# EAGLE schematic L_C_ext_esp32 (EAGLE 9.6.2)
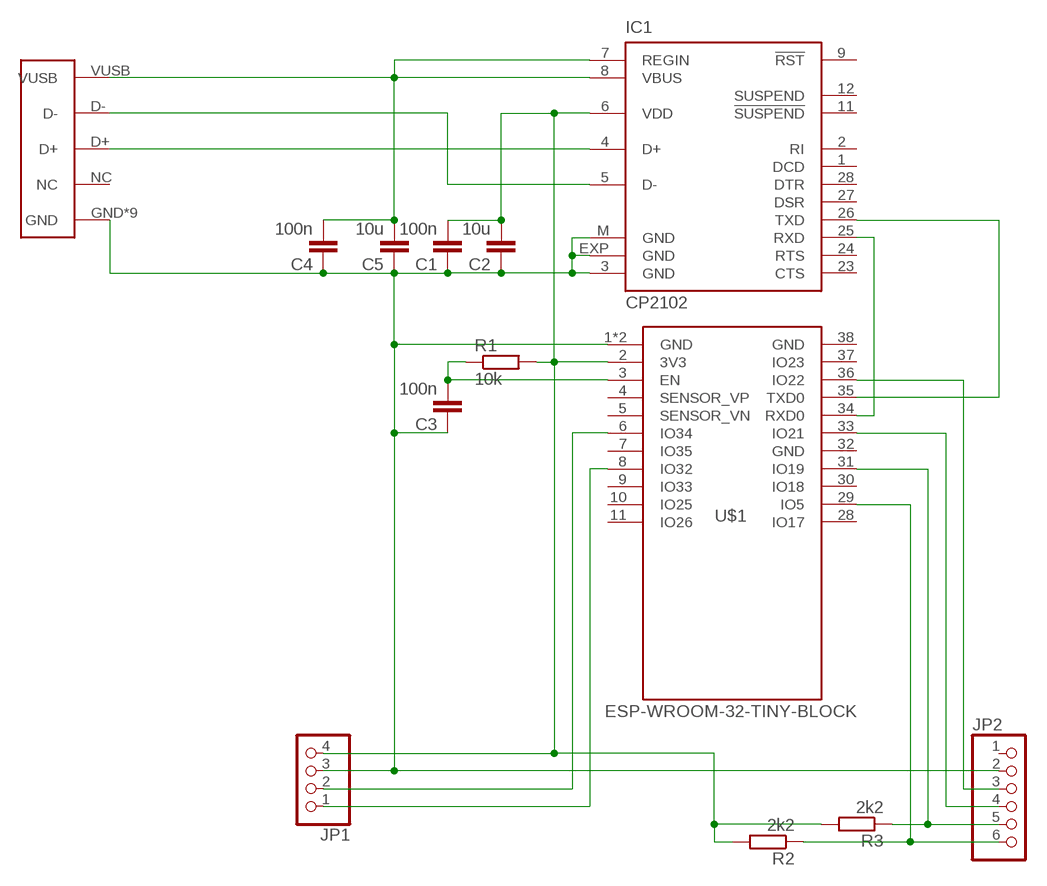
[diagram p0: schematic, sheet 1]

## Parts
C1  100n  C-EUC0805K  [C0805K]
C2  10u  C-EUC0805K  [C0805K]
C3  100n  C-EUC0805K  [C0805K]
C4  100n  C-EUC0805K  [C0805K]
C5  10u  C-EUC0805K  [C0805K]
IC1  CP2102  [MLP28]
JP1  PINHD-1X4  [1X04]
JP2  PINHD-1X6  [1X06]
R1  10k  R-EU_R0805  [R0805]
R2  2k2  R-EU_R0805  [R0805]
R3  2k2  R-EU_R0805  [R0805]
U$1  ESP-WROOM-32-TINY-BLOCK  [ESP-WROOM-32-TINY-BLOCK]
USB  USBMICRO  [MICROUSB-MOLEX]

## Nets
EN: C3.2 R1.1 U$1.3(EN)
GND: C1.1 C2.1 C3.1 C4.1 C5.1 IC1.3(GND) IC1.EXP(GND) IC1.M(GND) JP1.3 JP2.2 U$1.1(GND) U$1.GND USB.GND USB.GND1(GND) USB.GND2(GND) USB.GND3(GND) USB.GND4(GND) USB.P$1(GND) USB.P$2(GND) USB.P$3(GND) USB.P$6(GND)
N$1: IC1.5(D-) USB.D-
N$2: IC1.4(D+) USB.D+
N$4: IC1.26(TXD) U$1.35(TXD0)
N$6: IC1.25(RXD) U$1.34(RXD0)
N$12: C4.2 C5.2 IC1.7(REGIN) IC1.8(VBUS) USB.VUSB
P0: JP1.2 U$1.6(IO34)
P1: JP1.1 U$1.8(IO32)
P4: JP2.3 U$1.36(IO22)
SCL: JP2.5 R3.1 U$1.31(IO19)
SDA: JP2.6 R2.1 U$1.29(IO5)
UPDI: JP2.4 U$1.33(IO21)
VCC: C1.2 C2.2 IC1.6(VDD) JP1.4 R1.2 R2.2 R3.2 U$1.2(3V3)
Unconnected: IC1.1(DCD) IC1.2(RI) IC1.9(!RST) IC1.11(!SUSPEND) IC1.12(SUSPEND) IC1.23(CTS) IC1.24(RTS) IC1.27(DSR) IC1.28(DTR) JP2.1 U$1.4(SENSOR_VP) U$1.5(SENSOR_VN) U$1.7(IO35) U$1.9(IO33) U$1.10(IO25) U$1.11(IO26) U$1.28(IO17) U$1.30(IO18) U$1.37(IO23) USB.NC

## Power pins joined to a net without a drawn wire
GND: U$1.32(GND) U$1.38(GND)

## Library data of the parts
C1-C5 = rcl:C-EU: CAPACITOR, European symbol; SPICEPREFIX: C
IC1 = silabs:CP210*: Single-Chip USB to UART Bridge Source: www.silabs.com .. CP2101.pdf / cp2102.pdf; MF: FARNELL; MPN: CP2102-GM; OC_FARNELL: 9282130; OC_NEWARK: 30K5635
JP1 = pinhead2:PINHD-1X4: PIN HEADER
JP2 = pinhead2:PINHD-1X6: PIN HEADER
R1-R3 = rcl:R-EU_: RESISTOR, European symbol; SPICEPREFIX: R
U$1 = esp32:ESP-WROOM-32-TINY-BLOCK
USB = !stavebnice03:USBMICRO